# EAGLE design bt-programmer (EAGLE 6.1)
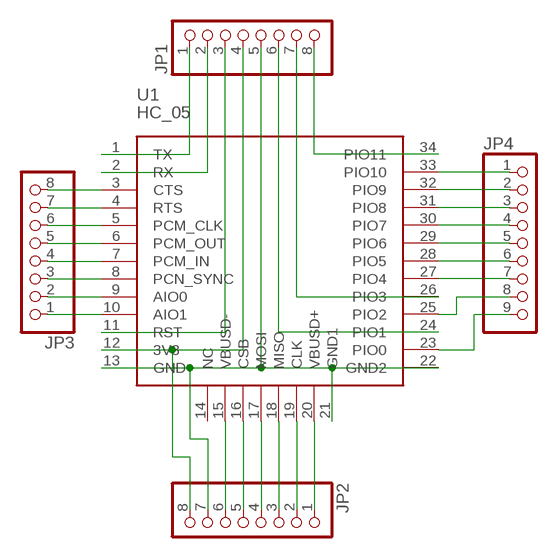
[diagram p0: schematic, sheet 1]

## Parts
JP1  PINHD-1X8  [1X08]
JP2  PINHD-1X8  [1X08]
JP3  PINHD-1X8  [1X08]
JP4  PINHD-1X9  [1X09]
U1  HC_05  [BLUETOOTH_SMD]

## Nets
N$1: JP1.1 U1.1(TX)
N$2: JP1.2 U1.2(RX)
N$3: JP1.4 JP2.8 U1.12(3V3)
N$4: JP1.5 JP2.7 U1.13(GND) U1.21(GND1) U1.22(GND2)
N$11: JP1.3 U1.11(RST)
N$12: JP1.8 U1.34(PIO11)
N$13: JP1.7 U1.26(PIO3)
N$14: JP1.6 U1.24(PIO1)
N$21: JP2.6 U1.15(VBUSD-)
N$22: JP2.5 U1.16(CSB)
N$23: JP2.4 U1.17(MOSI)
N$24: JP2.3 U1.18(MISO)
N$25: JP2.2 U1.19(CLK)
N$26: JP2.1 U1.20(VBUSD+)
N$31: JP3.1 U1.10(AIO1)
N$32: JP3.2 U1.9(AIO0)
N$33: JP3.3 U1.8(PCN_SYNC)
N$34: JP3.4 U1.7(PCM_IN)
N$35: JP3.5 U1.6(PCM_OUT)
N$36: JP3.6 U1.5(PCM_CLK)
N$37: JP3.7 U1.4(RTS)
N$38: JP3.8 U1.3(CTS)
N$39: JP4.1 U1.33(PIO10)
N$40: JP4.2 U1.32(PIO9)
N$41: JP4.3 U1.31(PIO8)
N$42: JP4.4 U1.30(PIO7)
N$43: JP4.5 U1.29(PIO6)
N$44: JP4.6 U1.28(PIO5)
N$45: JP4.7 U1.27(PIO4)
N$46: JP4.8 U1.25(PIO2)
N$47: JP4.9 U1.23(PIO0)
Unconnected: U1.14(NC)

## Library data of the parts
JP1-JP3 = pinhead:PINHD-1X8: PIN HEADER
JP4 = pinhead:PINHD-1X9: PIN HEADER
U1 = SerialPortBluetooth:HC_05

## Board
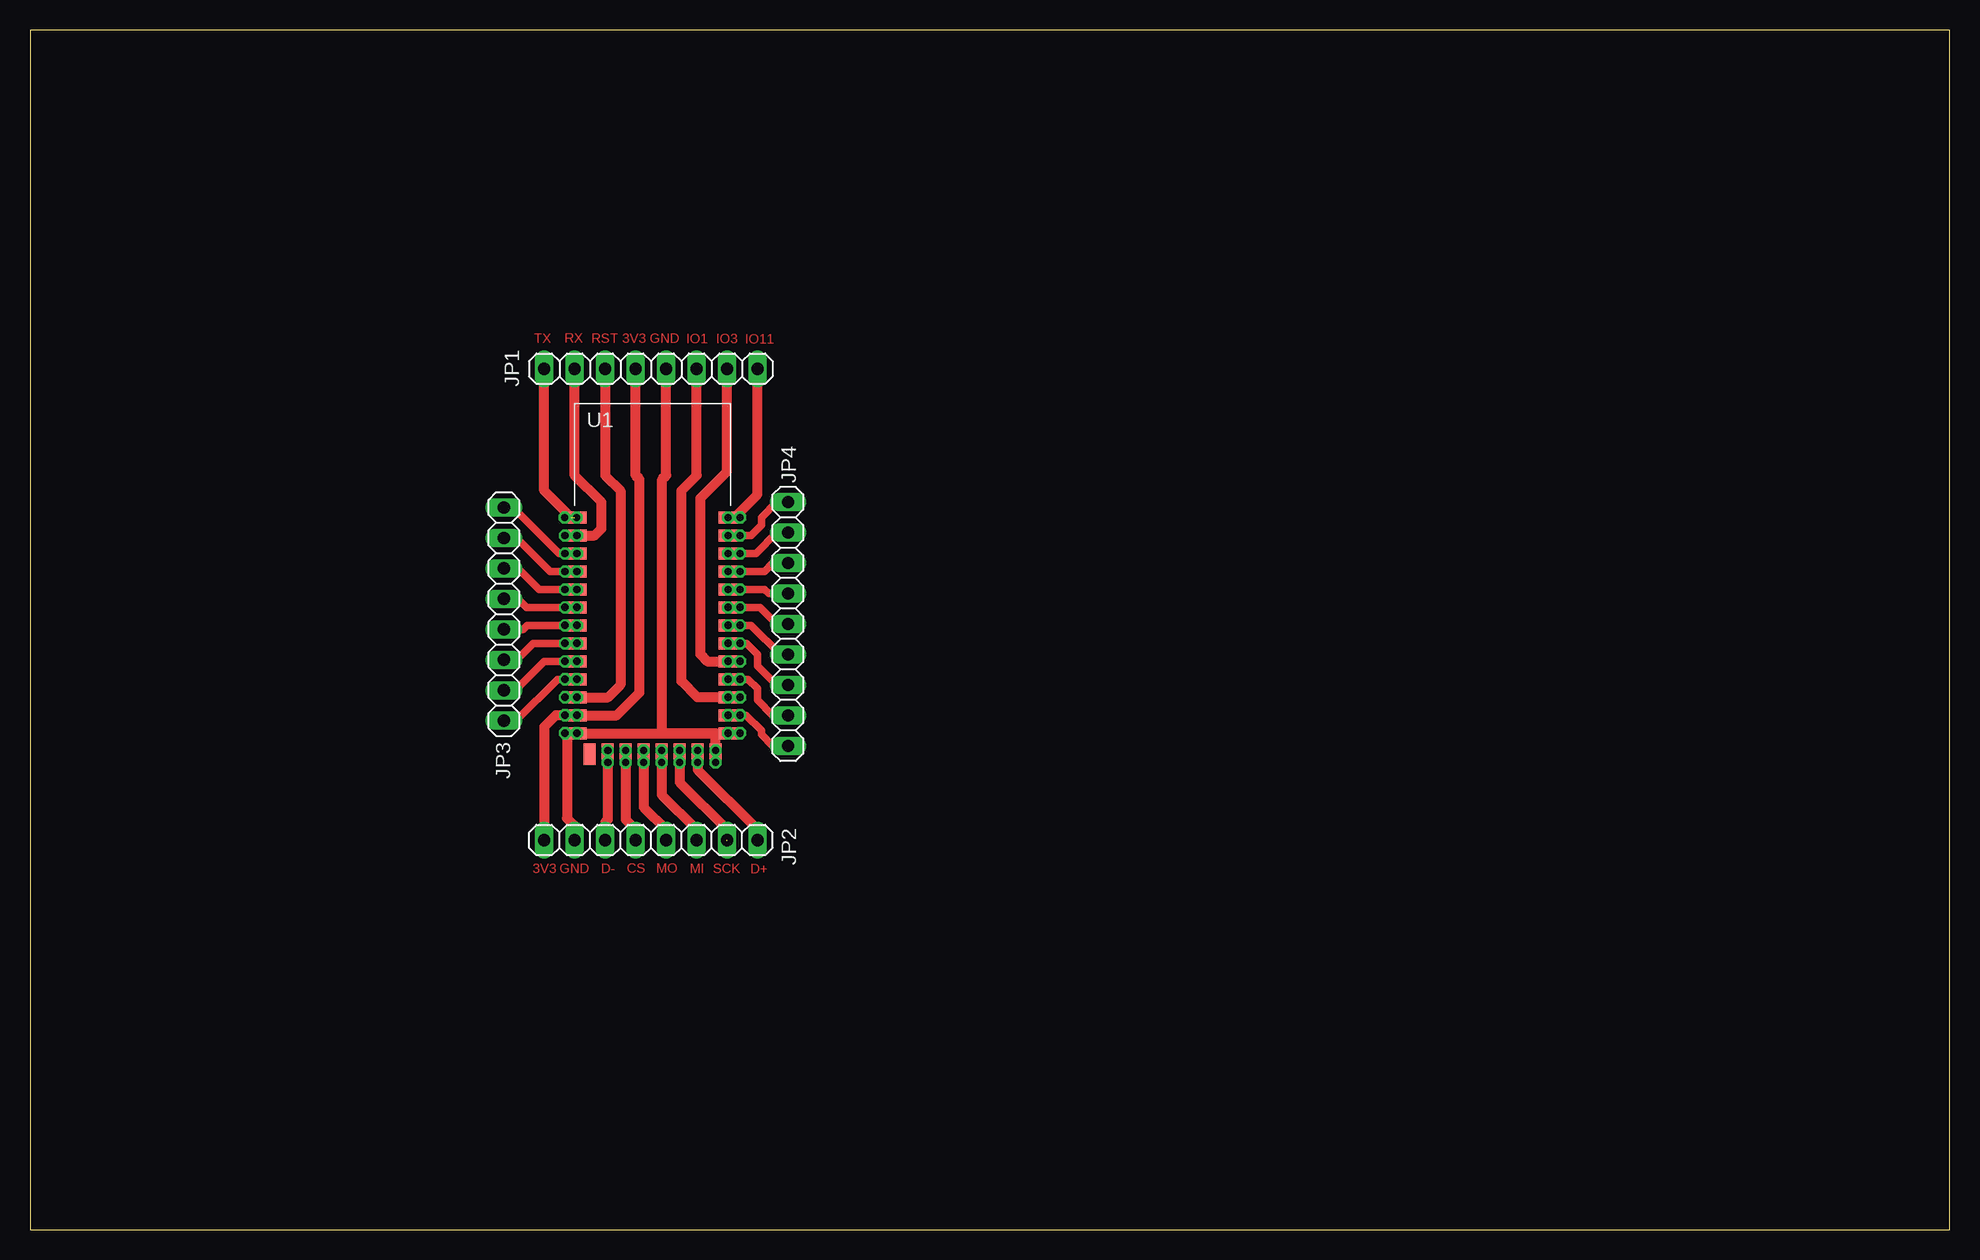
[diagram p1: board, top side]

Size 160 x 100 mm. Coordinates in mm from the lower left corner, seen from the top.
Outline: 0,0 160,0 160,100 0,100 0,0
Copper layers (1*16): Top 0.035mm / dielectric 1.5mm / Bottom 0.035mm
Design rules: minimum track width 10mil, minimum drill 24mil, track to track 8mil, track to pad 8mil, pad to pad 8mil, via to via 8mil, smd to smd 8mil, copper to edge 40mil, drill to drill 8mil, minimum pad ring 10mil, minimum via ring 8mil, stop-mask expansion 4mil, vias tented up to drill 0mil, thermal gap 10mil

### Footprints (pad centres in the part's own frame; a part is rotated, then mirrored left to right if it is on the bottom)
1X08 = drill 1.016 long: 1 -8.89,0; 2 -6.35,0; 3 -3.81,0; 4 -1.27,0; 5 1.27,0; 6 3.81,0; 7 6.35,0; 8 8.89,0
1X09 = drill 1.016 long: 1 -10.16,0; 2 -7.62,0; 3 -5.08,0; 4 -2.54,0; 5 0,0; 6 2.54,0; 7 5.08,0; 8 7.62,0; 9 10.16,0
BLUETOOTH_SMD = smd 2 x 1: 1 0,0; 2 0,-1.5; 3 0,-3; 4 0,-4.5; 5 0,-6; 6 0,-7.5; 7 0,-9; 8 0,-10.5; 9 0,-12; 10 0,-13.5; 11 0,-15; 12 0,-16.5; 13 0,-18; 22 13,-18; 23 13,-16.5; 24 13,-15; 25 13,-13.5; 26 13,-12; 27 13,-10.5; 28 13,-9; 29 13,-7.5; 30 13,-6; 31 13,-4.5; 32 13,-3; 33 13,-1.5; 34 13,0 | smd 1 x 1.8: 14 1.25,-19.75; 15 2.75,-19.75; 16 4.25,-19.75; 17 5.75,-19.75; 18 7.25,-19.75; 19 8.75,-19.75; 20 10.25,-19.75; 21 11.75,-19.75

### Placement (x,y rotation side)
JP1  51.75,71.75 0 top
JP2  51.75,32.46 180 top
JP3  39.5,51.31 90 top
JP4  63.18,50.48 270 top
U1  45.4,59.37 0 top

### Tracks (layer width: path | path; a pad name or v marks a point on that pad's centre or on a via)
N$1  (1 unrouted)
  Top 0.813: 45.09,59.37 42.86,61.59 JP1.1
N$2
  Top 0.813: U1.2 47.08,57.87 47.62,58.42 47.62,60.64 45.4,62.87 JP1.2
N$3
  Top 0.813: JP1.4 50.48,62.87 50.8,62.55 50.8,44.77 48.91,42.87 U1.12 43.83,42.87 42.86,41.91 JP2.8
N$4
  Top 0.813: 57.15,41.37 U1.13 45.18,41.37 44.77,41.27 44.77,34.29 45.4,33.66 JP2.7 | 57.15,41.37 U1.22 | U1.21 57.15,41.37 | 57.15,41.37 | 57.15,41.37 52.7,41.37 52.7,62.55 53.02,62.87 JP1.5
N$5  (via drill 0.6)
  other vias: 48.16,38.94
N$6  (via drill 0.6)
  other vias: 49.66,38.94
N$7  (via drill 0.6)
  other vias: 51.16,38.94
N$8  (via drill 0.6)
  other vias: 52.65,38.94
N$9  (via drill 0.6)
  other vias: 54.15,38.94
N$10  (via drill 0.6)
  other vias: 48.16,39.93
N$11
  Top 0.813: JP1.3 47.94,62.87 49.21,61.59 49.21,45.4 48.18,44.37 U1.11
N$12
  Top 0.813: U1.34 58.74,59.37 60.64,61.28 JP1.8
N$13
  Top 0.813: JP1.7 58.1,63.18 55.88,60.96 55.88,47.94 56.45,47.37 U1.26
N$14
  Top 0.813: U1.24 55.64,44.37 54.29,45.72 54.29,61.59 55.56,62.87 JP1.6
N$15  (via drill 0.6)
  other vias: 49.66,39.93
N$16  (via drill 0.6)
  other vias: 51.16,39.93
N$17  (via drill 0.6)
  other vias: 52.65,39.93
N$18  (via drill 0.6)
  other vias: 54.15,39.93
N$19  (via drill 0.6)
  other vias: 55.65,39.93
N$20  (via drill 0.6)
  other vias: 57.15,39.93
N$21
  Top 0.813: U1.15 48.15,34.18 47.94,33.97 JP2.6
N$22
  Top 0.813: U1.16 49.65,34.17 50.48,33.34 JP2.5
N$23
  Top 0.813: U1.17 51.15,35.21 53.02,33.34 JP2.4
N$24
  Top 0.813: U1.18 52.65,36.25 55.56,33.34 JP2.3
N$25  (1 unrouted)
  Top 0.813: U1.19 54.15,37.29 58.1,33.34 58.1,32.38
N$26
  Top 0.813: U1.20 55.65,38.33 60.64,33.34 JP2.1
N$27  (via drill 0.6)
  other vias: 58.19,41.38
N$28  (via drill 0.6)
  other vias: 58.19,44.37
N$29  (via drill 0.6)
  other vias: 58.19,47.37
N$30  (via drill 0.6)
  other vias: 58.19,59.36
N$31
  Top 0.61: U1.10 43.97,45.87 40.51,42.42 JP3.1
N$32
  Top 0.61: JP3.2 40.45,44.96 42.86,47.37 U1.9
N$33
  Top 0.61: U1.8 41.95,48.87 40.58,47.5 JP3.3
N$34
  Top 0.61: U1.7 41.42,50.37 41.08,50.04 JP3.4
N$35
  Top 0.61: U1.6 41.41,51.87 40.7,52.58 JP3.5
N$36
  Top 0.61: U1.5 42.45,53.37 40.7,55.12 JP3.6
N$37
  Top 0.61: U1.4 43.36,54.87 40.58,57.66 JP3.7
N$38
  Top 0.61: U1.3 44.08,56.37 40.26,60.2 JP3.8
N$39
  Top 0.61: U1.33 60.09,57.87 60.96,58.74 60.96,59.37 62.23,60.64 JP4.1
N$40
  Top 0.61: U1.32 60.5,56.37 62.23,58.1 JP4.2
N$41
  Top 0.61: U1.31 61.22,54.87 61.91,55.56 JP4.3
N$42
  Top 0.61: U1.30 61.24,53.37 61.59,53.02 JP4.4
N$43
  Top 0.61: U1.29 60.84,51.87 62.23,50.48 JP4.5
N$44
  Top 0.61: U1.28 60.12,50.37 62.55,47.94 JP4.6
N$45
  Top 0.61: U1.27 59.71,48.87 60.64,47.94 60.64,46.99 62.23,45.4 JP4.7
N$46
  Top 0.61: U1.25 59.85,45.87 60.64,45.09 60.64,44.13 61.91,42.86 JP4.8
N$47
  Top 0.61: U1.23 59.68,42.87 60.96,41.59 60.96,41.27 61.91,40.32 JP4.9
N$48  (via drill 0.6)
  other vias: 55.65,38.94
N$49  (via drill 0.6)
  other vias: 57.15,38.94
N$50  (via drill 0.6)
  other vias: 59.18,41.38
N$51  (via drill 0.6)
  other vias: 59.18,44.37
N$52  (via drill 0.6)
  other vias: 59.18,47.37
N$53  (via drill 0.6)
  other vias: 59.18,59.36
N$54  (via drill 0.6)
  other vias: 59.18,57.86
N$55  (via drill 0.6)
  other vias: 59.18,56.36
N$56  (via drill 0.6)
  other vias: 58.19,57.86
N$57  (via drill 0.6)
  other vias: 58.19,56.36
N$58  (via drill 0.6)
  other vias: 58.19,54.86
N$59  (via drill 0.6)
  other vias: 58.19,53.37
N$60  (via drill 0.6)
  other vias: 58.19,51.87
N$61  (via drill 0.6)
  other vias: 58.19,50.37
N$62  (via drill 0.6)
  other vias: 58.19,48.87
N$63  (via drill 0.6)
  other vias: 58.19,45.87
N$64  (via drill 0.6)
  other vias: 58.19,42.88
N$65  (via drill 0.6)
  other vias: 44.56,59.36 45.55,59.36
N$66  (via drill 0.6)
  other vias: 44.59,57.86 45.58,57.86
N$67  (via drill 0.6)
  other vias: 44.59,44.37 45.58,44.37
N$68  (via drill 0.6)
  other vias: 44.59,42.88 45.58,42.88
N$69  (via drill 0.6)
  other vias: 44.59,41.38 45.58,41.38
N$70  (via drill 0.6)
  other vias: 44.59,45.87 45.58,45.87
N$71  (via drill 0.6)
  other vias: 44.59,47.37 45.58,47.37
N$72  (via drill 0.6)
  other vias: 44.59,48.87 45.58,48.87
N$73  (via drill 0.6)
  other vias: 44.59,50.37 45.58,50.37
N$74  (via drill 0.6)
  other vias: 44.59,51.87 45.58,51.87
N$75  (via drill 0.6)
  other vias: 44.59,53.37 45.58,53.37
N$76  (via drill 0.6)
  other vias: 44.59,54.86 45.58,54.86
N$77  (via drill 0.6)
  other vias: 44.59,56.36 45.58,56.36
N$78  (via drill 0.6)
  other vias: 59.18,54.86
N$79  (via drill 0.6)
  other vias: 59.18,53.37
N$80  (via drill 0.6)
  other vias: 59.18,51.87
N$81  (via drill 0.6)
  other vias: 59.18,50.37
N$82  (via drill 0.6)
  other vias: 59.18,48.87
N$83  (via drill 0.6)
  other vias: 59.18,45.87
N$84  (via drill 0.6)
  other vias: 59.18,42.88

### Text on the board
Top: TX | RX | RST | 3V3 | GND | IO1 | IO3 | IO11 | 3V3 | GND | D- | CS | MO | MI | SCK | D+